# Altium project PCB_Project.PrjPcb
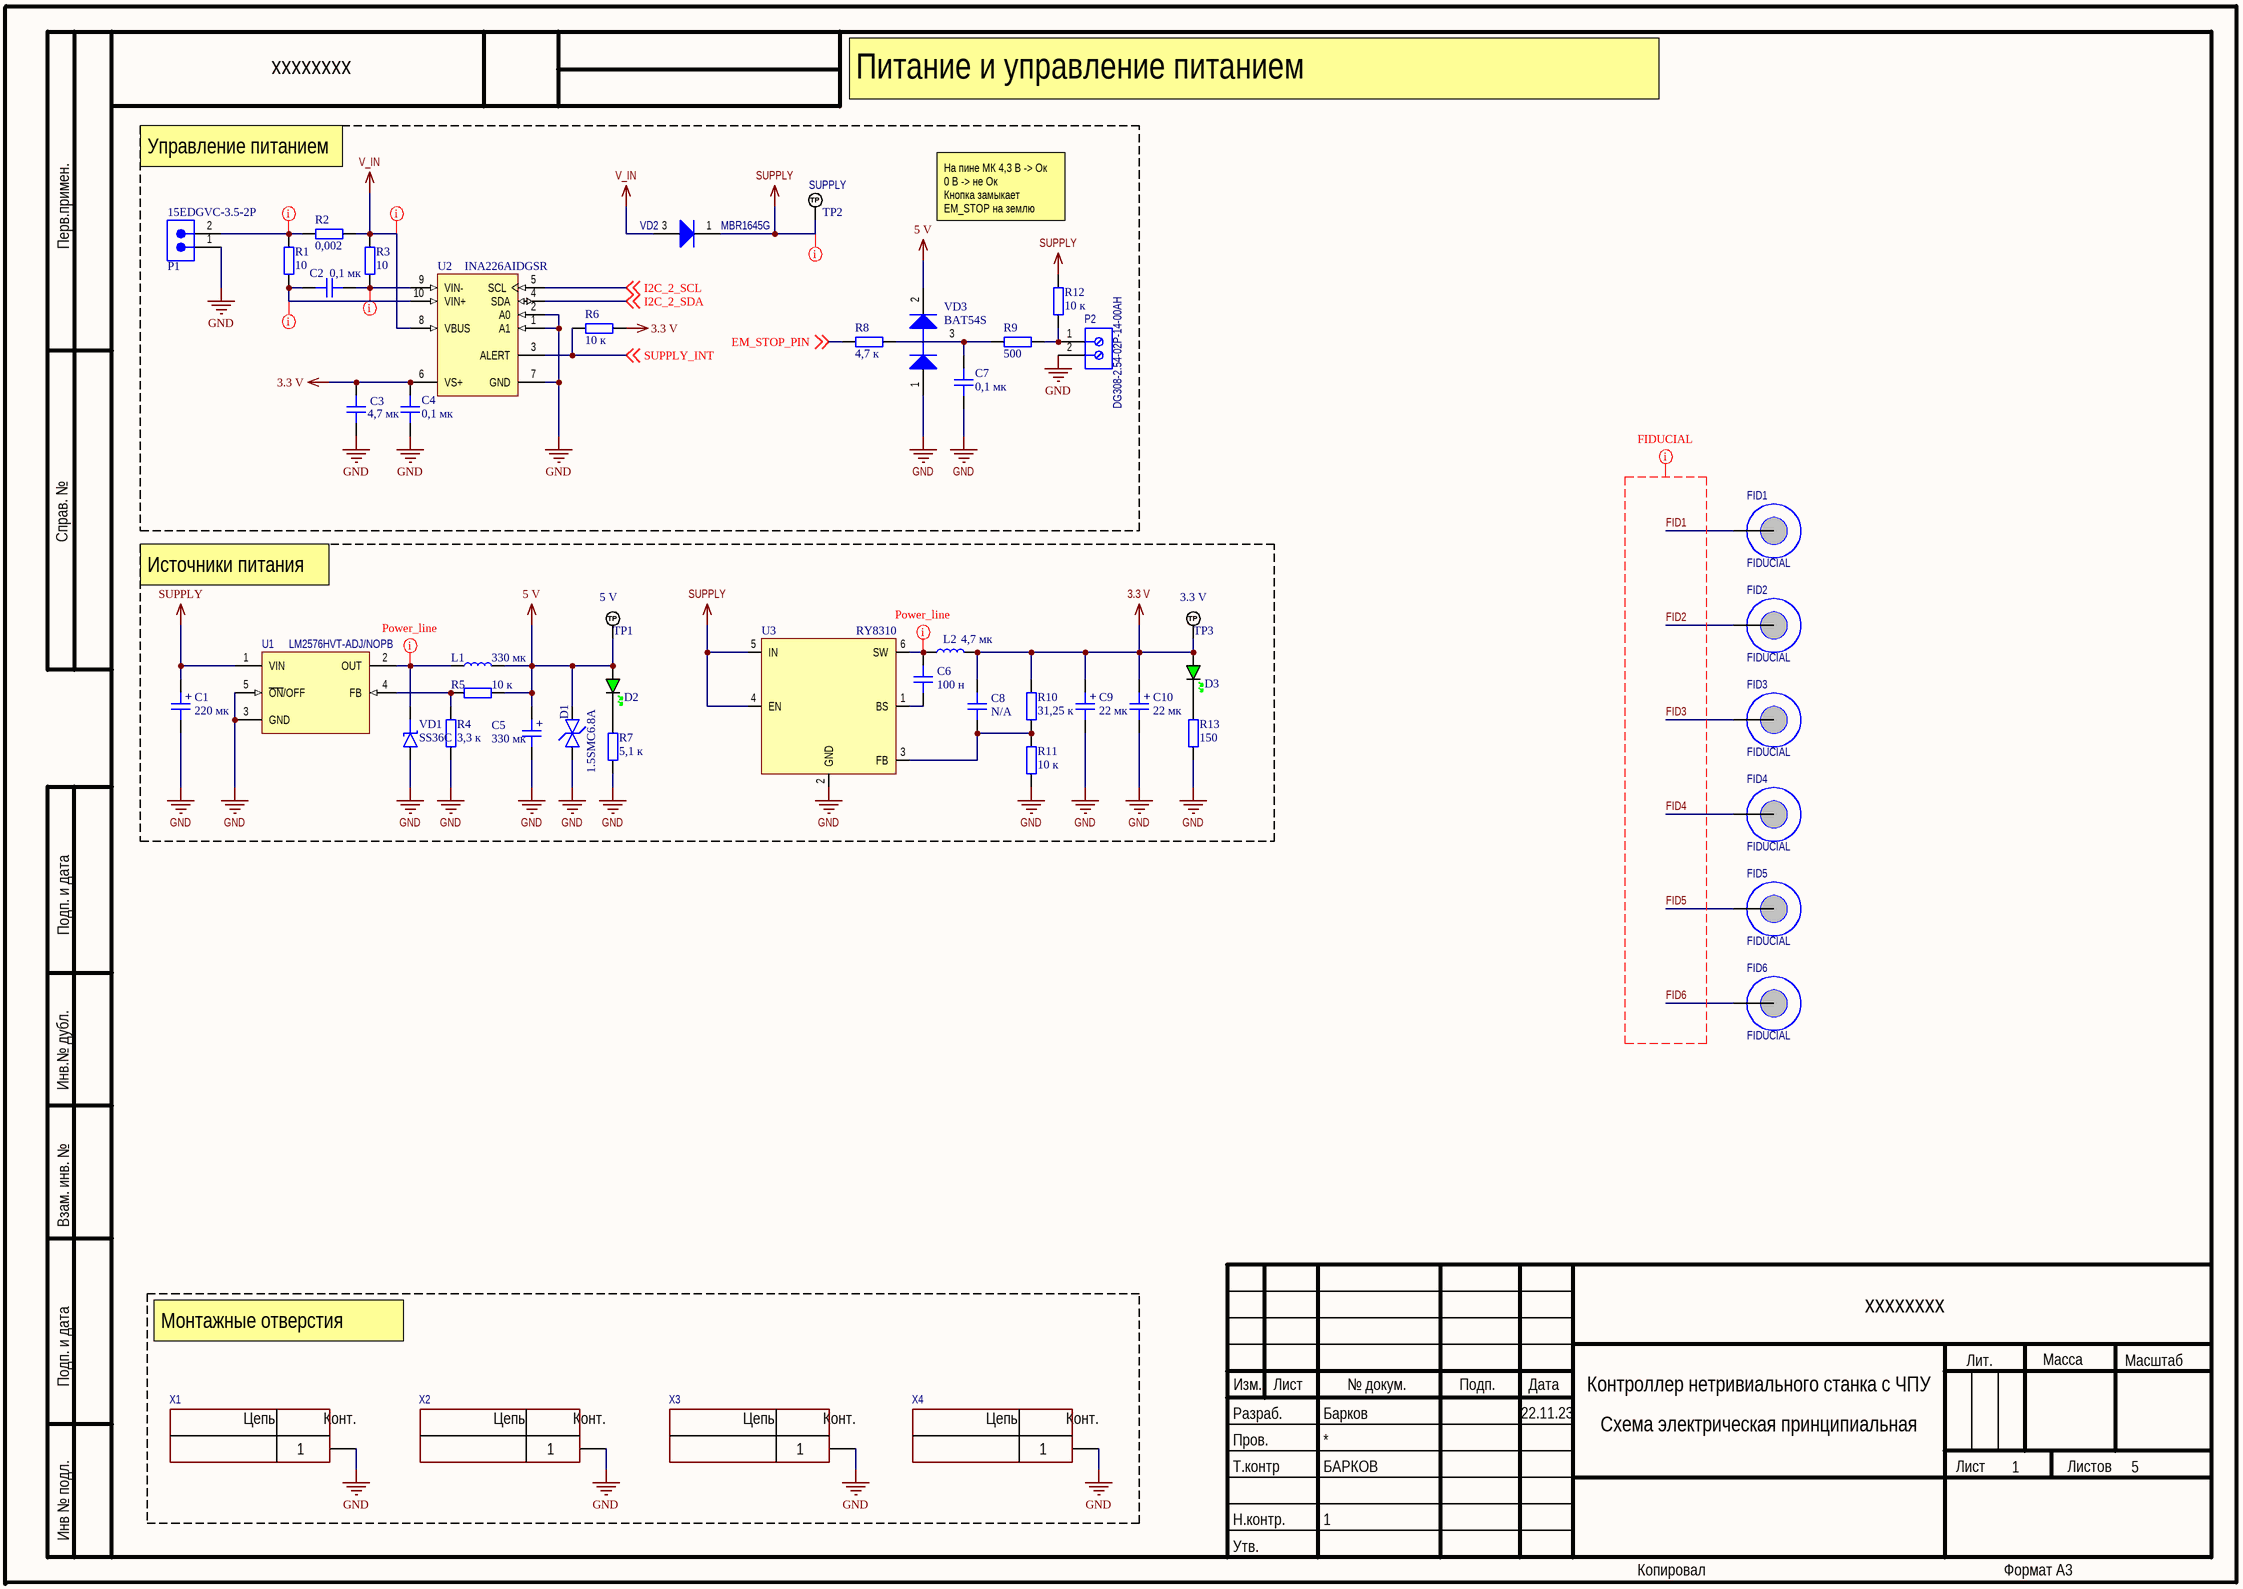
[diagram p0: Sheet1.SchDoc]
3 sheets, 190 parts. Net scope: global (net labels, ports and power ports of the same name join across sheets).
Board file: PCB1.PcbDoc
Sheets:
  Sheet1.SchDoc
  Sheet2.SchDoc
  Sheet4.SchDoc

## Sheet Sheet1.SchDoc: Контроллер нетривиального станка с ЧПУ
size 420 x 297 mm; Date: 22.11.23; Author: Барков; CompanyName: BarCockSemenConductor; DrawnBy: Барков; Engineer: БАРКОВ; Organization: BarCockSemenConductor; DocumentNumber: хххххххх; Revision: 1; SheetNumber: 1; SheetTotal: 5

### Parts
C1  220 мк  [D10C5H12.5]
C2  0,1 мк  [CAP_0603]
C3  4,7 мк  [CAP_0805]
C4  0,1 мк  [CAP_0603]
C5  330 мк  [D8C3.5H12]
C6  100 н  [CAP_0603]
C7  0,1 мк  [CAP_0603]
C8  N/A  [CAP_0603]
C9  22 мк  [TANTAL_B]
C10  22 мк  [TANTAL_B]
D1  1.5SMC6.8A  [SMC-DO-214AB]
D2  GREEN  [LED_0603_GREEN]  (value not drawn)
D3  GREEN  [LED_0603_GREEN]  (value not drawn)
FID1  FIDUCIAL  [FIDUCIAL]
FID2  FIDUCIAL  [FIDUCIAL]
FID3  FIDUCIAL  [FIDUCIAL]
FID4  FIDUCIAL  [FIDUCIAL]
FID5  FIDUCIAL  [FIDUCIAL]
FID6  FIDUCIAL  [FIDUCIAL]
L1  330 мк  [IND: B82477G4]
L2  4,7 мк  [NRS5020]
P1  15EDGVC-3.5-2P  [691321100002]
P2  DG308-2.54-02P-14-00AH  [PHOE-1725656-2]
R1  10  [RES_0603]
R2  0,002  [ch2512r]
R3  10  [RES_0603]
R4  3,3 к  [RES_0603]
R5  10 к  [RES_0603]
R6  10 к  [RES_0603]
R7  5,1 к  [RES_0603]
R8  4,7 к  [RES_0603]
R9  500  [RES_0603]
R10  31,25 к  [RES_0603]
R11  10 к  [RES_0603]
R12  10 к  [RES_0603]
R13  150  [RES_0603]
TP1  5 V  [PAD_RND_1MM]  (no BOM)
TP2  SUPPLY  [PAD_RND_1MM]  (no BOM)
TP3  3.3 V  [PAD_RND_1MM]  (no BOM)
U1  LM2576HVT-ADJ/NOPB  [KC0005A]
U2  INA226AIDGSR  [DGS0010A_L]
U3  RY8310  [SOT-23-6]
VD1  SS36C  [SMC-DO-214AB]
VD2  MBR1645G  [ONSC-TO-220-2-221B-04_E]
VD3  BAT54S  [ONSC-SOT-323-3-419-04_V]
X1  *  [CON: PADS 1x3mm]  (value not drawn)  (no BOM)
X2  *  [CON: PADS 1x3mm]  (value not drawn)  (no BOM)
X3  *  [CON: PADS 1x3mm]  (value not drawn)  (no BOM)
X4  *  [CON: PADS 1x3mm]  (value not drawn)  (no BOM)

### Nets
3.3 V: C3.2 C4.1 C8.2 C9.1 C10.1 D3.A L2.2 R6.2 R10.1 TP3.1(TP) U2.6(VS+)
5 V: C5.1 D1.K D2.A L1.2 R5.1 TP1.1(TP) VD3.2(K)
GND: C1.2 C3.1 C4.2 C5.2 C7.2 C9.2 C10.2 D1.A P1.1 P2.2 R4.1 R7.1 R11.2 R13.1 U1.3(GND) U1.5(~{ON}/OFF) U2.1(A1) U2.2(A0) U2.7(GND) U3.2(GND) VD1.A VD3.1(A) X1.1 X2.1 X3.1 X4.1
SUPPLY: C1.1 R12.2 TP2.1(TP) U1.1(VIN) U3.4(EN) U3.5(IN) VD2.1(K)
V_IN: R2.2 R3.1 U2.8(VBUS) VD2.3(A)
EM_STOP_PIN: R8.2 ; off-sheet EM_STOP_PIN
FID1: FID1.1
FID2: FID2.1
FID3: FID3.1
FID4: FID4.1
FID5: FID5.1
FID6: FID6.1
I2C_2_SCL: U2.5(SCL) ; off-sheet I2C_2_SCL
I2C_2_SDA: U2.4(SDA) ; off-sheet I2C_2_SDA
SUPPLY_INT: R6.1 U2.3(ALERT) ; off-sheet SUPPLY_INT
NetC2_1: C2.1 R3.2 U2.9(VIN-)
NetC2_2: C2.2 R1.2 U2.10(VIN+)
NetC6_1: C6.1 U3.1(BS)
NetC6_2: C6.2 L2.1 U3.6(SW)
NetC7_1: C7.1 R8.1 R9.2 VD3.3(K/A)
NetC8_1: C8.1 R10.2 R11.1 U3.3(FB)
NetD2_K: D2.K R7.2
NetD3_K: D3.K R13.2
NetL1_1: L1.1 U1.2(OUT) VD1.K
NetP1_2: P1.2 R1.1 R2.1
NetP2_1: P2.1 R9.1 R12.1
NetR4_2: R4.2 R5.2 U1.4(FB)

### Layout directives
net class Power_line: NetC6_2, NetL1_1
net class Low_Power_Line: NetC2_1, NetC2_2, NetP1_2, SUPPLY, V_IN
net class FIDUCIAL: FID1, FID2, FID3, FID4, FID5, FID6

### Notes on the sheet
- Питание и управление питанием
- Управление питанием
- На пине МК 4,3 В -> Ок
  0 В -> не Ок
  Кнопка замыкает EM_STOP на землю
- Источники питания
- Монтажные отверстия
- Перв.примен.
- Справ. №
- Подп. и дата
- Инв.№ дубл.
- Взам. инв. №
- Изм.
- Лист
- № докум.
- Подп.
- Дата
- Лит.
- Масса
- Масштаб
- Пров.
- Т.контр
- Разраб.
- Схема электрическая принципиальная
- 1
- Листов
- Инв № подл.
- Н.контр.
- Утв.
- Копировал
- Формат А3
- (in symbol 1-Connector) Цепь; Конт.
- (in symbol CAP_ALEL_16x16.5_25V) +

### Library data of the parts
C1 = CAP_ALEL_16x16.5_25V: Электролитический конденсатор; Voltage: 50; Type: CAP_ELECTROLYTIC; ChipDip: 9000565903; Model: JRB1H221M05001000120000B; Value: 220 мк; Mount: THT
C2 C4 C7 = CAP_0603: Керамический конденсатор; Type: CAP_CERAMIC; Value: 0,1 мк; ChipDip: *; Mount: SMD
C3 C6 C8 = CAP_0805: Керамический конденсатор; Type: CAP_CERAMIC; Mount: SMD
  C3: Value: 4,7 мк; ChipDip: *
  C6: Value: 100 н
  C8: Value: N/A
C5 = CAP_ALEL_16x16.5_25V: Электролитический конденсатор; Voltage: 16; Type: CAP_ELECTROLYTIC; ChipDip: 9000565907; Model: JRB1C331M03500800120000B; Value: 330 мк; Mount: THT
C9 C10 = CAP_ALEL_16x16.5_25V: Танталовый конденсатор; Voltage: 6,3; Type: CAP_TANTALUM; ChipDip: 9000629219; Value: 22 мк; Model: *; Mount: SMD
D1 = D_TVS_BI_SMC: Защитный диод; ChipDip: 9001169270; Value: 5 В; Type: DIODE; Model: 1.5SMC6.8A; Mount: SMD
D2 D3 = LED_0603_GREEN: Зелёный светодиод; Type: LED; Model: *; ChipDip: *; Value: GREEN; Mount: SMD
FID1-FID6 = FIDUCIAL: Реперная метка; Mount: SMD; Type: FIDUCIAL
L1 = NRS5020: Индуктор; ChipDip: 450851416; Type: INDUCTOR; Model: B82477G4334M; Value: 330 мк; Mount: SMD
L2 = NRS5020: Индуктор; ChipDip: 450851416; Type: INDUCTOR; Value: 4,7 мк; Mount: SMD
P1 = CMP-1502-01783-2: Раъёмный винтовой клеммник; ChipDip: 8025411938; Model: 15EDGVC-3.5-2P; Type: CONNETOR; Mount: THT
P2 = CMP-2000-05299-1: Винтовой клеммник; ChipDip: 63066; Model: DG308-2.54-02P-14-00AH; Type: CONNECTOR; Mount: THT
R1 R3-R9 R12 R13 = RES_0603: Резистор; Type: RESISTOR; ChipDip: *; Mount: SMD
  R1 R3: Value: 10
  R4: Value: 3,3 к
  R5 R6 R12: Value: 10 к
  R7: Value: 5,1 к
  R8: Value: 4,7 к
  R9: Value: 500
  R13: Value: 150
R2 = RES_0603: Резистор; ChipDip: 8001939518; Model: CRE2512-FZ-R002E-3; Value: 0,002; Type: RESISTOR; Mount: SMD
R10 R11 = RES_0805: Резистор; Type: RESISTOR; Mount: SMD
  R10: Value: 31,25 к
  R11: Value: 10 к
TP1-TP3 = TEST_POINT_RND_1MM: Type: *
  TP1: CustomTxt: 5 V
  TP2: CustomTxt: SUPPLY
  TP3: CustomTxt: 3.3 V
U1 = CMP-0069-01994-3: Понижающий DC-DC; ChipDip: 9000135775; ComponentLink1Description: Datasheet URL; ComponentLink1URL: http://www.ti.com/general/docs/lit/getliterature.tsp?genericPartNumber=LM2576HV&fileType=pdf; Type: IC; Model: LM2576HVT-ADJ/NOPB; Mount: THT
U2 = CMP-0704-00058-2: Измеритель мощности; ChipDip: 8026989887; ComponentLink2URL: http://www.ti.com/general/docs/lit/getliterature.tsp?genericPartNumber=INA226&fileType=pdf; ComponentLink1URL: http://www.ti.com/; ComponentLink3Description: Package Specification; ComponentLink2Description: Datasheet; ComponentLink3URL: http://www.ti.com/lit/ml/mpds035b/mpds035b.pdf; ComponentLink1Description: Manufacturer URL; Model: INA226AIDGSR; Type: IC; Mount: SMD
U3 = MT2492: Понижающий DC-DC; ChipDip: 8026700717; Model: RY8310; Type: IC; Mount: SMD
VD1 = D_SCHOTTKY_SMC: Диод; ChipDip: 9000982605; Type: DIODE; Value: SS36C; Mount: SMD
VD2 = CMP-1055-00599-1: Мощный диод; ChipDip: 9000520102; Type: DIODE; ComponentLink3URL: http://www.onsemi.com/pub_link/Collateral/BYW29-D.PDF; ComponentLink1URL: http://www.onsemi.com/; ComponentLink2URL: http://www.onsemi.cn/pub_link/Collateral/MBR1635-D.PDF; ComponentLink3Description: Package Specification; ComponentLink2Description: Datasheet; ComponentLink1Description: Manufacturer URL; Model: MBR1645G; Mount: THT
VD3 = CMP-1055-00559-1: Пара последовательных диодов; ChipDip: 9001106105; Type: DIODE; ComponentLink1URL: http://www.onsemi.com/; ComponentLink1Description: Manufacturer URL; ComponentLink3URL: http://www.onsemi.com/pub_link/Collateral/419-04.PDF; ComponentLink2URL: http://www.onsemi.cn/pub_link/Collateral/BAT54SWT1-D.PDF; ComponentLink3Description: Package Specification; ComponentLink2Description: Datasheet; Model: BAT54S; Mount: SMD
X1-X4 = 1-Connector

## Sheet Sheet2.SchDoc: Контроллер нетривиального станка с ЧПУ
size 420 x 297 mm; Author: Барков; CompanyName: BarCockSemenConductor; DrawnBy: Барков; Engineer: Барков; Organization: BarCockSemenConductor; DocumentNumber: хххххххх; Revision: 1; SheetNumber: 2; SheetTotal: 5
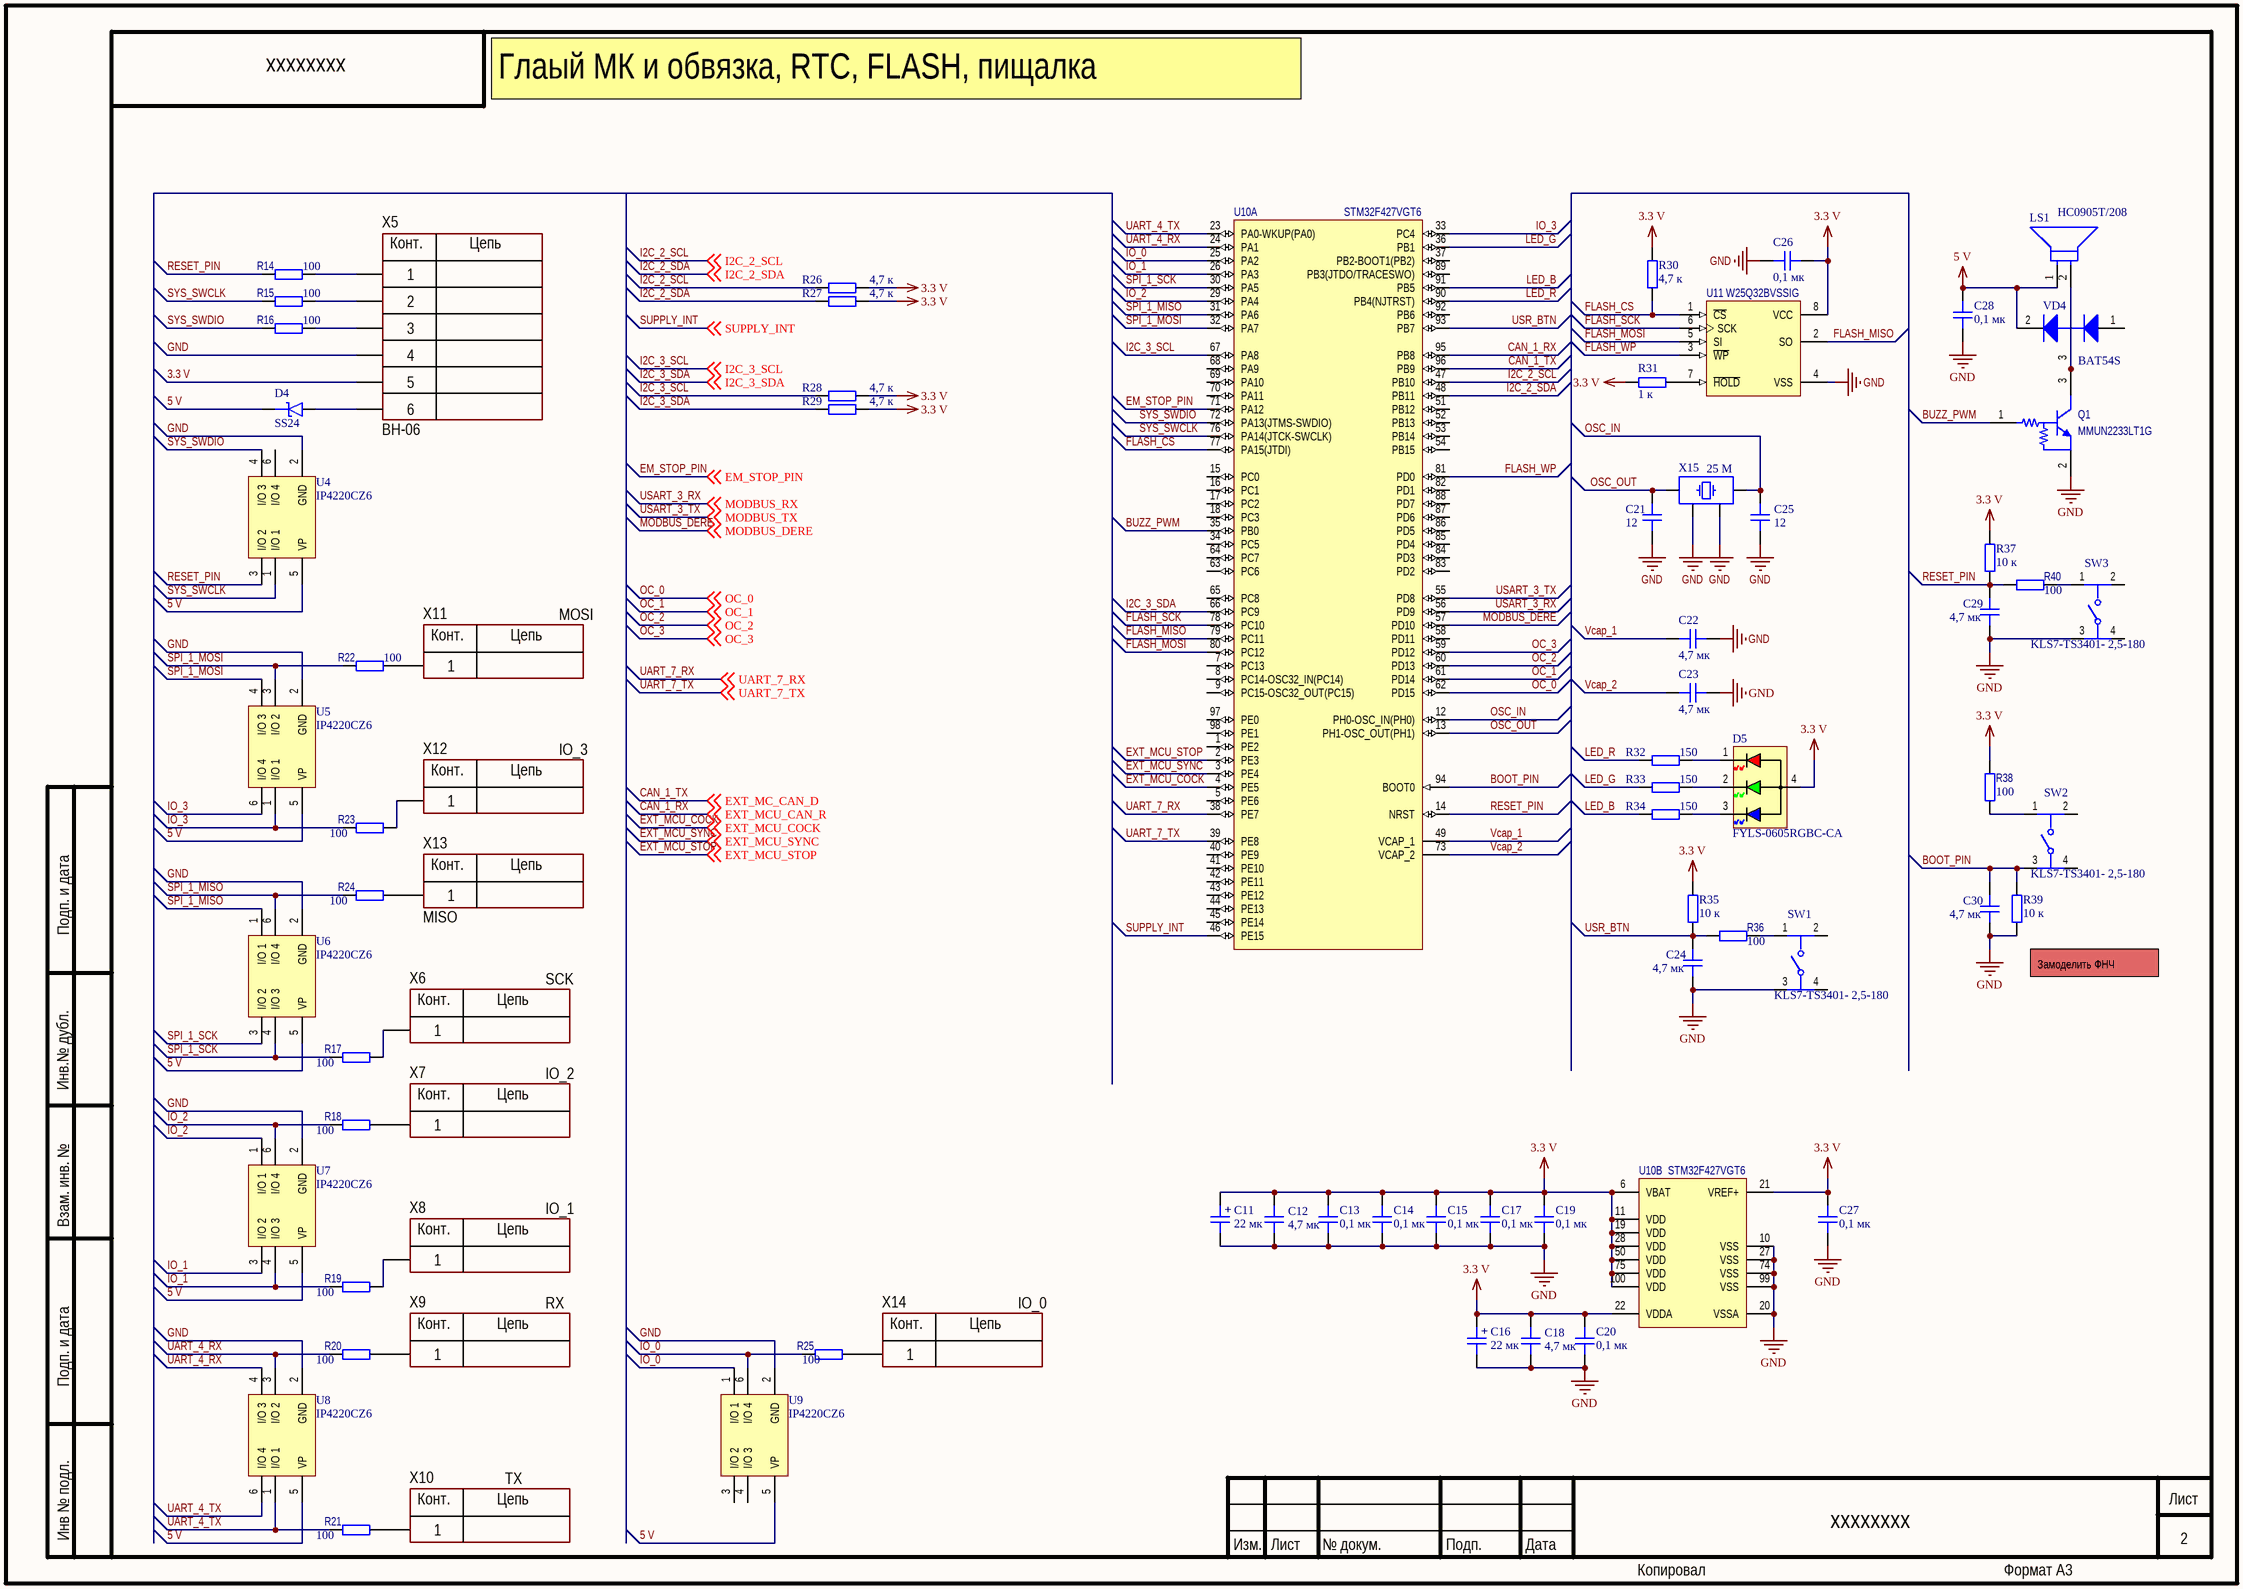
[diagram p1: Sheet2.SchDoc]

### Parts
C11  22 мк  [TANTAL_B]
C12  4,7 мк  [CAP_0805]
C13  0,1 мк  [CAP_0603]
C14  0,1 мк  [CAP_0603]
C15  0,1 мк  [CAP_0603]
C16  22 мк  [TANTAL_B]
C17  0,1 мк  [CAP_0603]
C18  4,7 мк  [CAP_0805]
C19  0,1 мк  [CAP_0603]
C20  0,1 мк  [CAP_0603]
C21  12  [CAP_0603]
C22  4,7 мк  [CAP_0805]
C23  4,7 мк  [CAP_0805]
C24  4,7 мк  [CAP_0805]
C25  12  [CAP_0603]
C26  0,1 мк  [CAP_0603]
C27  0,1 мк  [CAP_0603]
C28  0,1 мк  [CAP_0603]
C29  4,7 мк  [CAP_0805]
C30  4,7 мк  [CAP_0805]
D4  SS24  [DO-214AC-2 (SMA)]
D5  FYLS-0605RGBC-CA  [150080M153000]
LS1  HC0905T/208  [FP-SD1209-MFG]
Q1  MMUN2233LT1G  [ONSC-SOT-23-3-318-08_V]
R14  100  [RES_0603]
R15  100  [RES_0603]
R16  100  [RES_0603]
R17  100  [RES_0603]
R18  100  [RES_0603]
R19  100  [RES_0603]
R20  100  [RES_0603]
R21  100  [RES_0603]
R22  100  [RES_0603]
R23  100  [RES_0603]
R24  100  [RES_0603]
R25  100  [RES_0603]
R26  4,7 к  [RES_0603]
R27  4,7 к  [RES_0603]
R28  4,7 к  [RES_0603]
R29  4,7 к  [RES_0603]
R30  4,7 к  [RES_0603]
R31  1 к  [RES_0603]
R32  150  [RES_0603]
R33  150  [RES_0603]
R34  150  [RES_0603]
R35  10 к  [RES_0603]
R36  100  [RES_0603]
R37  10 к  [RES_0603]
R38  100  [RES_0603]
R39  10 к  [RES_0603]
R40  100  [RES_0603]
SW1  KLS7-TS3401- 2,5-180  [FP-PTS810_SJG_250_SMTR_LF-MFG]
SW2  KLS7-TS3401- 2,5-180  [FP-PTS810_SJG_250_SMTR_LF-MFG]
SW3  KLS7-TS3401- 2,5-180  [FP-PTS810_SJG_250_SMTR_LF-MFG]
U4  IP4220CZ6  [NXP-SOT457_L]
U5  IP4220CZ6  [NXP-SOT457_L]
U6  IP4220CZ6  [NXP-SOT457_L]
U7  IP4220CZ6  [NXP-SOT457_L]
U8  IP4220CZ6  [NXP-SOT457_L]
U9  IP4220CZ6  [NXP-SOT457_L]
U10  STM32F427VGT6  [STM-LQFP100_M]  (parts A,B of 2)
U11  W25Q32BVSSIG  [SOIJ-SM8_L]
VD4  BAT54S  [ONSC-SOT-323-3-419-04_V]
X5  BH-06  [CON: IDC-6MS]
X6  SCK  [CON: PADS 1x1mm]  (no BOM)
X7  IO_2  [CON: PADS 1x1mm]  (no BOM)
X8  IO_1  [CON: PADS 1x1mm]  (no BOM)
X9  RX  [CON: PADS 1x1mm]  (no BOM)
X10  TX  [CON: PADS 1x1mm]  (no BOM)
X11  MOSI  [CON: PADS 1x1mm]  (no BOM)
X12  IO_3  [CON: PADS 1x1mm]  (no BOM)
X13  MISO  [CON: PADS 1x1mm]  (no BOM)
X14  IO_0  [CON: PADS 1x1mm]  (no BOM)
X15  25 M  [XTAL_3225]

### Nets
3.3 V: C11.1 C12.1 C13.1 C14.1 C15.1 C16.1 C17.1 C18.1 C19.1 C20.1 C26.2 C27.1 D5.4(AC) R26.2 R27.2 R28.2 R29.2 R30.2 R31.1 R35.1 R37.1 R38.2 U10.6(VBAT) U10.11(VDD) U10.19(VDD) U10.21(VREF+) U10.22(VDDA) U10.28(VDD) U10.50(VDD) U10.75(VDD) U10.100(VDD) U11.8(VCC) X5.5
5 V: C28.1 D4.K LS1.1(C) U4.5(VP) U5.5(VP) U6.5(VP) U7.5(VP) U8.5(VP) U9.5(VP) VD4.2(K)
GND: C11.2 C12.2 C13.2 C14.2 C15.2 C16.2 C17.2 C18.2 C19.2 C20.2 C21.2 C22.1 C23.1 C24.2 C25.2 C26.1 C27.2 C28.2 C29.2 C30.2 Q1.2(E) R39.2 SW1.3 SW3.3 U4.2(GND) U5.2(GND) U6.2(GND) U7.2(GND) U8.2(GND) U9.2(GND) U10.10(VSS) U10.20(VSSA) U10.27(VSS) U10.74(VSS) U10.99(VSS) U11.4(VSS) X5.4 X15.2 X15.4
BOOT_PIN: C30.1 R39.1 SW2.3 U10.94(BOOT0)
BUZZ_PWM: Q1.1(B) U10.35(PB0)
CAN_1_RX: U10.95(PB8) ; off-sheet EXT_MCU_CAN_R  [also labelled EXT_MCU_CAN_R]
CAN_1_TX: U10.96(PB9) ; off-sheet EXT_MC_CAN_D  [also labelled EXT_MC_CAN_D]
EM_STOP_PIN: U10.71(PA12) ; off-sheet EM_STOP_PIN
EXT_MCU_COCK: U10.4(PE5) ; off-sheet EXT_MCU_COCK
EXT_MCU_STOP: U10.2(PE3) ; off-sheet EXT_MCU_STOP
EXT_MCU_SYNC: U10.3(PE4) ; off-sheet EXT_MCU_SYNC
FLASH_CS: R30.1 U10.77(PA15(JTDI)) U11.1(~{CS})
FLASH_MISO: U10.79(PC11) U11.2(SO)
FLASH_MOSI: U10.80(PC12) U11.5(SI)
FLASH_SCK: U10.78(PC10) U11.6(SCK)
FLASH_WP: U10.81(PD0) U11.3(~{WP})
I2C_2_SCL: R26.1 U10.47(PB10) ; off-sheet I2C_2_SCL
I2C_2_SDA: R27.1 U10.48(PB11) ; off-sheet I2C_2_SDA
I2C_3_SCL: R28.1 U10.67(PA8) ; off-sheet I2C_3_SCL
I2C_3_SDA: R29.1 U10.66(PC9) ; off-sheet I2C_3_SDA
IO_0: R25.1 U9.1(I/O_1) U9.6(I/O_4) U10.25(PA2)
IO_1: R19.1 U7.3(I/O_2) U7.4(I/O_3) U10.26(PA3)
IO_2: R18.1 U7.1(I/O_1) U7.6(I/O_4) U10.29(PA4)
IO_3: R23.1 U5.1(I/O_1) U5.6(I/O_4) U10.33(PC4)
LED_B: R34.1 U10.91(PB5)
LED_G: R33.1 U10.36(PB1)
LED_R: R32.1 U10.90(PB4(NJTRST))
MODBUS_DERE: U10.57(PD10) ; off-sheet MODBUS_DERE
OC_0: U10.62(PD15) ; off-sheet OС_0  [also labelled OС_0]
OC_1: U10.61(PD14) ; off-sheet OС_1  [also labelled OС_1]
OC_2: U10.60(PD13) ; off-sheet OС_2  [also labelled OС_2]
OC_3: U10.59(PD12) ; off-sheet OС_3  [also labelled OС_3]
OSC_IN: C25.1 U10.12(PH0-OSC_IN(PH0)) X15.3
OSC_OUT: C21.1 U10.13(PH1-OSC_OUT(PH1)) X15.1
RESET_PIN: C29.1 R14.1 R37.2 R40.2 U4.3(I/O_2) U10.14(NRST)
SPI_1_MISO: R24.1 U6.1(I/O_1) U6.6(I/O_4) U10.31(PA6)
SPI_1_MOSI: R22.1 U5.3(I/O_2) U5.4(I/O_3) U10.32(PA7)
SPI_1_SCK: R17.1 U6.3(I/O_2) U6.4(I/O_3) U10.30(PA5)
SUPPLY_INT: U10.46(PE15) ; off-sheet SUPPLY_INT
SYS_SWCLK: R15.1 U4.1(I/O_1) U10.76(PA14(JTCK-SWCLK))
SYS_SWDIO: R16.1 U4.4(I/O_3) U10.72(PA13(JTMS-SWDIO))
UART_4_RX: R20.1 U8.3(I/O_2) U8.4(I/O_3) U10.24(PA1)
UART_4_TX: R21.1 U8.1(I/O_1) U8.6(I/O_4) U10.23(PA0-WKUP(PA0))
UART_7_RX: U10.38(PE7) ; off-sheet UART_7_RX
UART_7_TX: U10.39(PE8) ; off-sheet UART_7_TX
USART_3_RX: U10.56(PD9) ; off-sheet MODBUS_RX  [also labelled MODBUS_RX]
USART_3_TX: U10.55(PD8) ; off-sheet MODBUS_TX  [also labelled MODBUS_TX]
USR_BTN: C24.1 R35.2 R36.2 U10.93(PB7)
Vcap_1: C22.2 U10.49(VCAP_1)
Vcap_2: C23.2 U10.73(VCAP_2)
NetD4_A: D4.A X5.6
NetD5_1: D5.1(CR) R32.2
NetD5_2: D5.2(CG) R33.2
NetD5_3: D5.3(CB) R34.2
NetLS1_2: LS1.2(A) Q1.3(C) VD4.3(K/A)
NetR14_2: R14.2 X5.1
NetR15_2: R15.2 X5.2
NetR16_2: R16.2 X5.3
NetR17_2: R17.2 X6.1
NetR18_2: R18.2 X7.1
NetR19_2: R19.2 X8.1
NetR20_2: R20.2 X9.1
NetR21_2: R21.2 X10.1
NetR22_2: R22.2 X11.1
NetR23_2: R23.2 X12.1
NetR24_2: R24.2 X13.1
NetR25_2: R25.2 X14.1
NetR31_2: R31.2 U11.7(~{HOLD})
NetR36_1: R36.1 SW1.1
NetR38_1: R38.1 SW2.1
NetR40_1: R40.1 SW3.1

Not connected (* = marked no-connect by the designer): SW1 2 4; SW2 2 4; SW3 2 4; U4 6(I/O_4); U9 3(I/O_2) 4(I/O_3); U10 1(PE2) 5(PE6) 7(PC13) 8(PC14-OSC32_IN(PC14)) 9(PC15-OSC32_OUT(PC15)) 15(PC0) 16(PC1) 17(PC2) 18(PC3) 34(PC5) 37(PB2-BOOT1(PB2)) 40(PE9) 41(PE10) 42(PE11) 43(PE12) 44(PE13) 45(PE14) 51(PB12) 52(PB13) 53(PB14) 54(PB15) 58(PD11) 63(PC6) 64(PC7) 65(PC8) 68(PA9) 69(PA10) 70(PA11) 82(PD1) 83(PD2) 84(PD3) 85(PD4) 86(PD5) 87(PD6) 88(PD7) 89(PB3(JTDO/TRACESWO)) 92(PB6) 97(PE0) 98(PE1); VD4 1(A)

### Notes on the sheet
- Глаый МК и обвязка, RTC, FLASH, пищалка
- Замоделить ФНЧ
- Подп. и дата
- Инв.№ дубл.
- Взам. инв. №
- Инв № подл.
- Изм.
- Лист
- № докум.
- Подп.
- Дата
- Копировал
- Формат А3
- (in symbol 1-Connector) Конт.; Цепь
- (in symbol 6-Connector) Конт.; Цепь
- (in symbol CAP_ALEL_16x16.5_25V) +

### Library data of the parts
C11 C16 = CAP_ALEL_16x16.5_25V: Capacitor SMD Aluminium Electrolytic 16x16.5mm 25V; Voltage: 6,3; Type: CAP_TANTALUM; ChipDip: 9000629219; Value: 22 мк; Model: *
C12 C18 C22-C24 C29 C30 = CAP_0805: Capacitor SMD 0805; Type: CAP_CERAMIC; Value: 4,7 мк; ChipDip: *
C13-C15 C17 C19-C21 C25-C28 = CAP_0603: Capacitor SMD 0603; Type: CAP_CERAMIC; ChipDip: *
  C13-C15 C17 C19 C20 C26-C28: Value: 0,1 мк
  C21 C25: Value: 12
D4 = D_SCHOTTKY_SMA: Diode Schottky SMD SMA (DO-214AA); ChipDip: 9001106111; Model: SS24; Type: DIODE
D5 = 150080M153000: RGB LED Common Anode SMD Diffused 0805 Top View; ChipDip: 9001271035; Model: FYLS-0605RGBC-CA; Type: LED
LS1 = CMP-08413-000009-1: AUDIO MAGNETIC XDCR 3-6V TH; ChipDip: 9000783782; Model: HC0905T/208; Type: SOUND
Q1 = CMP-0630-00251-1: Digital Transistor (BRT), R1=4.7 kOhm, R2=47 kOhm, NPN Transistor, 3-Pin SOT-23, Pb-Free, Tape and Reel; ChipDip: 8021345115; Type: MOSFET; ComponentLink3URL: http://www.onsemi.cn/pub_link/Collateral/318-08.PDF; ComponentLink1URL: http://www.onsemi.com/; ComponentLink3Description: Package Specification; ComponentLink2URL: http://www.onsemi.cn/pub_link/Collateral/DTC143Z-D.PDF; ComponentLink1Description: Manufacturer URL; ComponentLink2Description: Datasheet; Model: MMUN2233LT1G
R14-R40 = RES_0603: Resistor SMD 0603; Type: RESISTOR; ChipDip: *
  R14-R25 R36 R38 R40: Value: 100
  R26-R30: Value: 4,7 к
  R31: Value: 1 к
  R32-R34: Value: 150
  R35 R37 R39: Value: 10 к
SW1-SW3 = CMP-10040-000011-1: SWITCH TACTILE SPST-NO 0.05A 16V; ChipDip: 9000372886; ComponentLink2URL: https://www.ckswitches.com/media/1476/pts810.pdf; ComponentLink2Description: Datasheet; Model: KLS7-TS3401- 2,5-180; Type: SWITCH
U4-U9 = CMP-2000-06457-1: ChipDip: 9001067611; Model: IP4220CZ6; Type: IC
U10 = CMP-0243-00028-2: ARM Cortex-M4 32-bit MCU+FPU, 210 DMIPS, 1024 kB Flash, 256 kB Internal RAM, 82 I/Os, 100-pin LQFP, -40 to 85 degC, Tray; ChipDip: 9001570276; ComponentLink1Description: Manufacturer URL; ComponentLink2URL: http://www.st.com/st-web-ui/static/active/en/resource/technical/document/datasheet/DM00071990.pdf; ComponentLink1URL: http://www.st.com/web/en/home.html; ComponentLink2Description: Datasheet; ComponentLink3Description: Package Specification; ComponentLink3URL: http://www.st.com/st-web-ui/static/active/en/resource/technical/document/data_brief/DM00071938.pdf; Type: IC; Model: STM32F427VGT6
U11 = CMP-0165-00255-1: 1 Mbit SPI Bus Serial EEPROM, 8-Pin SOIC, Industrial Temperature, Tape and Reel; Model: W25Q32BVSSIG; Type: IC; ChipDip: *
VD4 = CMP-1055-00559-1: ChipDip: 9001106105; Type: DIODE; ComponentLink1URL: http://www.onsemi.com/; ComponentLink1Description: Manufacturer URL; ComponentLink3URL: http://www.onsemi.com/pub_link/Collateral/419-04.PDF; ComponentLink2URL: http://www.onsemi.cn/pub_link/Collateral/BAT54SWT1-D.PDF; ComponentLink3Description: Package Specification; ComponentLink2Description: Datasheet; Model: BAT54S
X5 = 6-Connector: ChipDip: 9000058155; Model: BH-06; Type: CONNECTOR
X6-X14 = 1-Connector
  X6: SIGNAL: SCK
  X7: SIGNAL: IO_2
  X8: SIGNAL: IO_1
  X9: SIGNAL: RX
  X10: SIGNAL: TX
  X11: SIGNAL: MOSI
  X12: SIGNAL: IO_3
  X13: SIGNAL: MISO
  X14: SIGNAL: IO_0
X15 = TSX-3225_24.0000MF15X-AC: Crystal SMD 24MHz 10PPM 7pF 3225; ChipDip: 8026581531; Model: X322525MOB4SI; Value: 25 M; Type: CRYSTAL

## Sheet Sheet4.SchDoc: Контроллер нетривиального станка с ЧПУ
size 420 x 297 mm; Author: Барков; CompanyName: BarCockSemenConductor; DrawnBy: Барков; Engineer: Барков; Organization: BarCockSemenConductor; DocumentNumber: хххххххх; SheetNumber: 4; SheetTotal: 5; DocumentName: Sheet1.SCHDOC
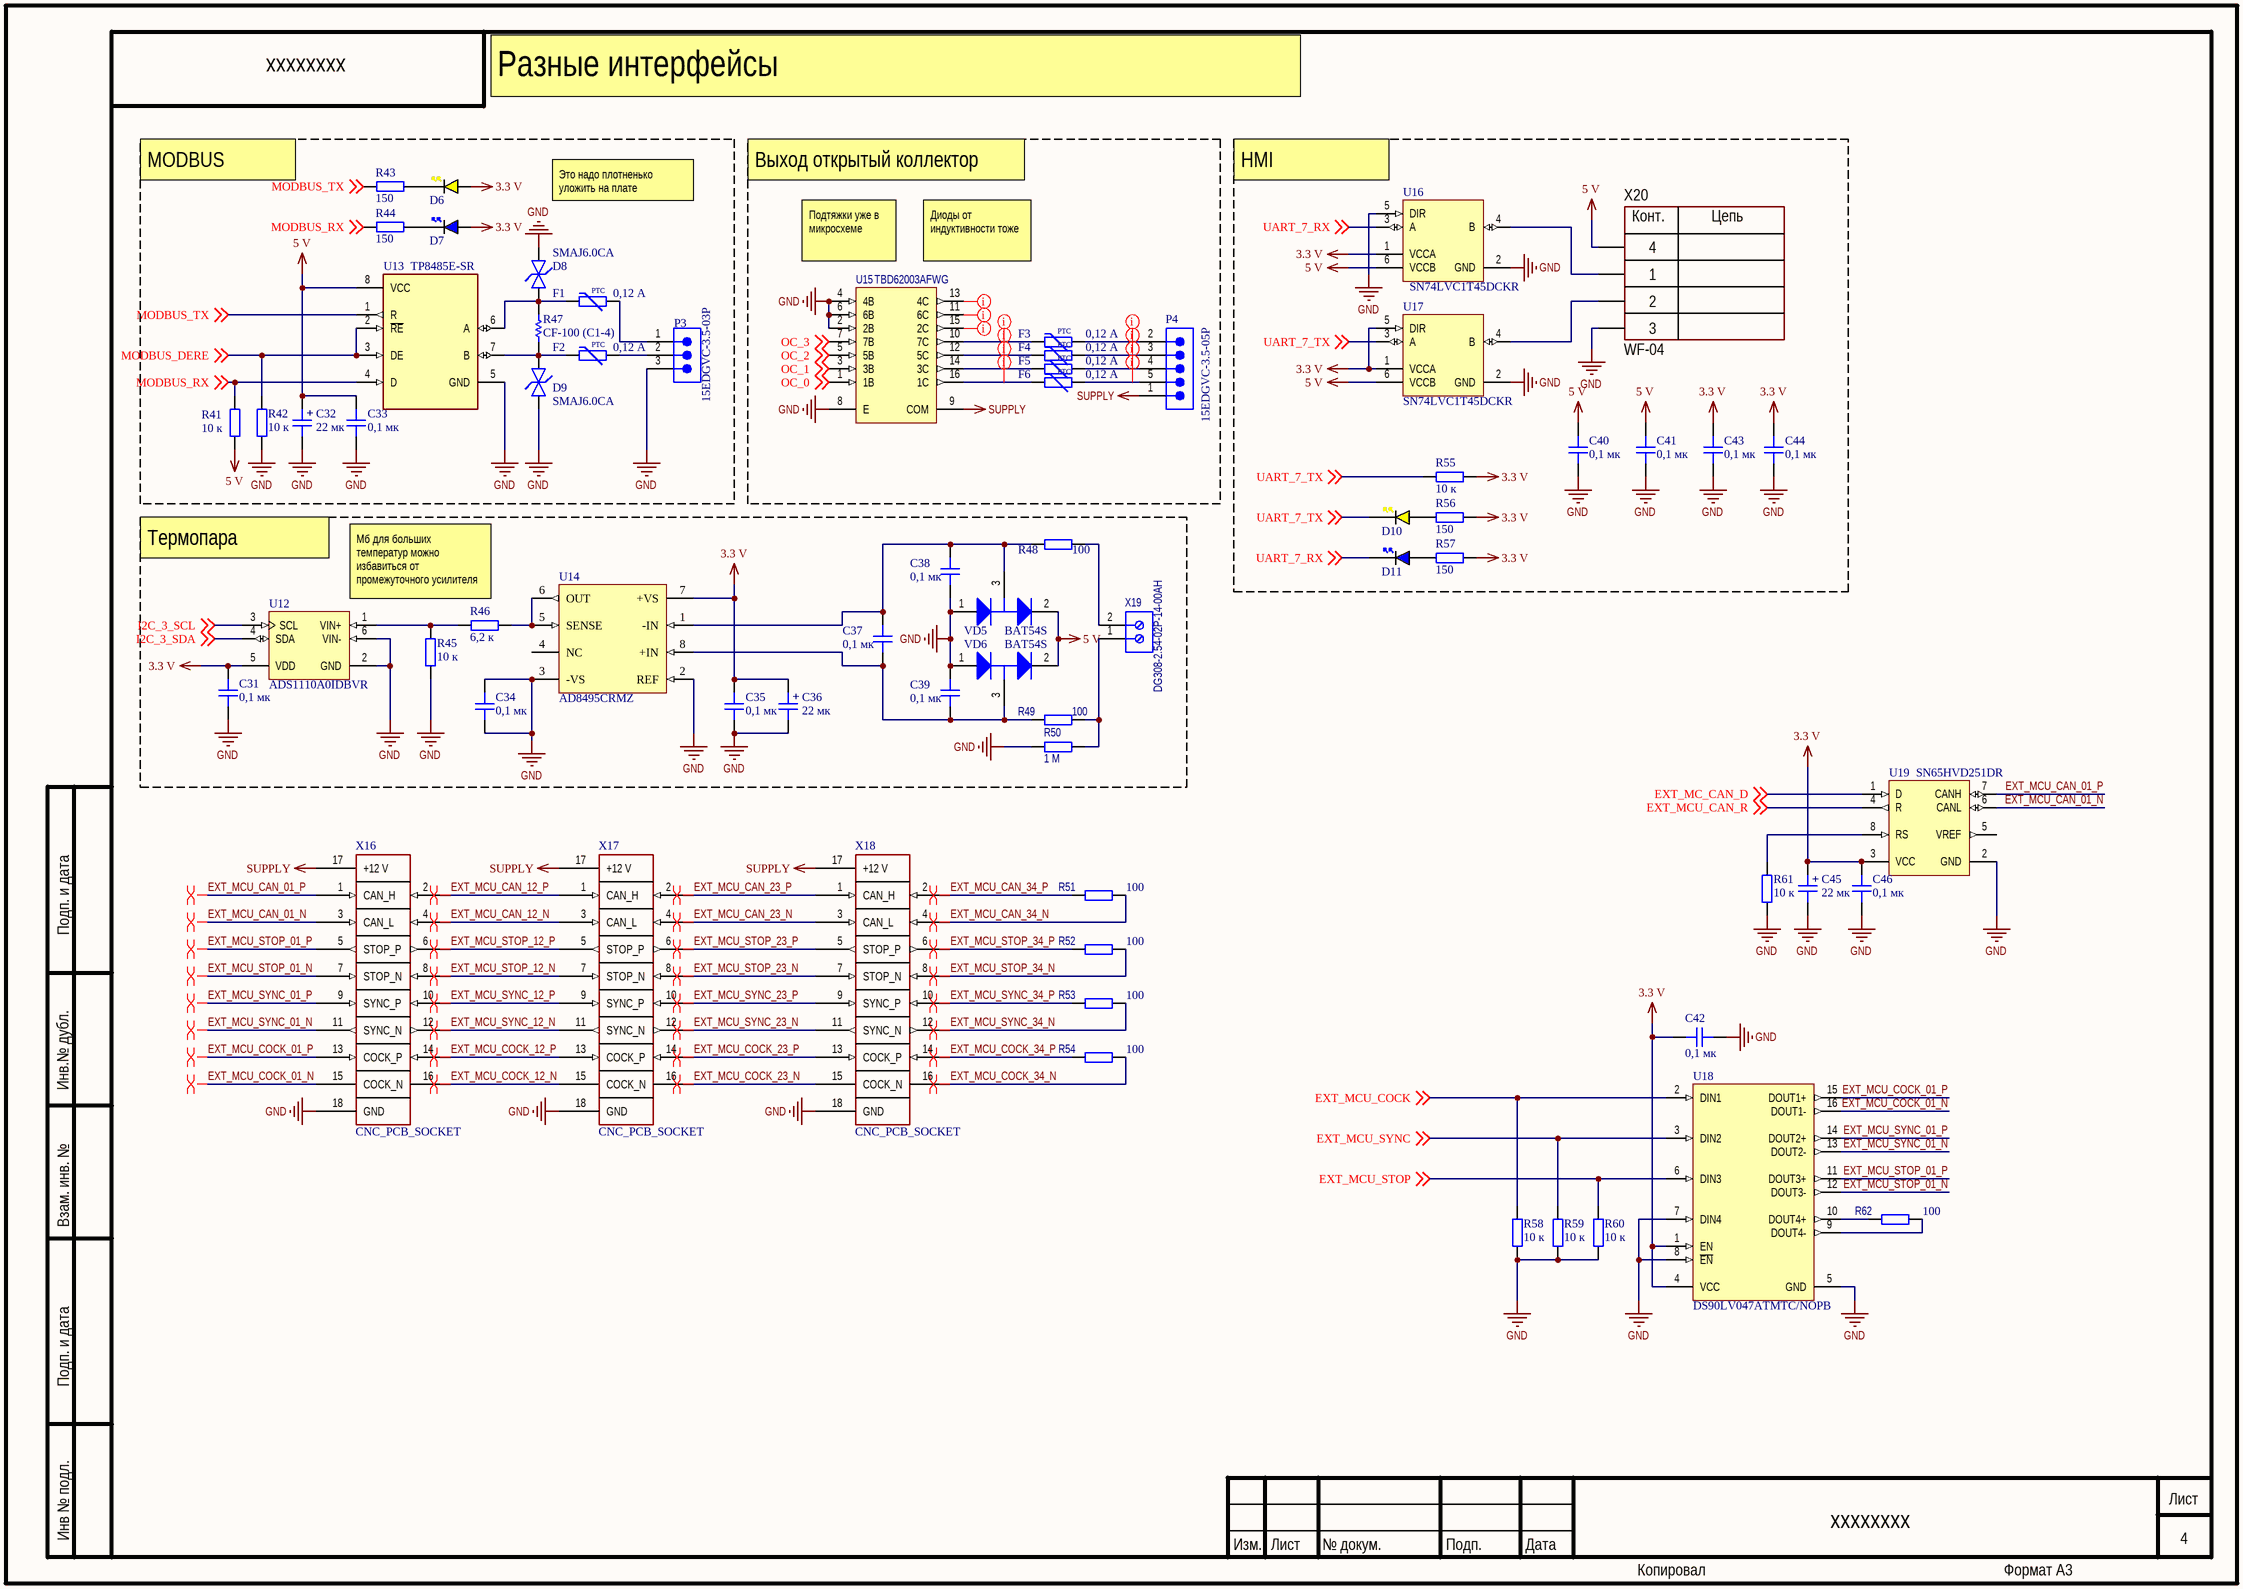
[diagram p2: Sheet4.SchDoc]

### Parts
C31  0,1 мк  [CAP_0603]
C32  22 мк  [TANTAL_B]
C33  0,1 мк  [CAP_0603]
C34  0,1 мк  [CAP_0603]
C35  0,1 мк  [CAP_0603]
C36  22 мк  [TANTAL_B]
C37  0,1 мк  [CAP_0603]
C38  0,1 мк  [CAP_0603]
C39  0,1 мк  [CAP_0603]
C40  0,1 мк  [CAP_0603]
C41  0,1 мк  [CAP_0603]
C42  0,1 мк  [CAP_0603]
C43  0,1 мк  [CAP_0603]
C44  0,1 мк  [CAP_0603]
C45  22 мк  [TANTAL_B]
C46  0,1 мк  [CAP_0603]
D6  YELLOW  [LED_0603_YELLOW]  (value not drawn)
D7  BLUE  [LED_0603_BLUE]  (value not drawn)
D8  SMAJ6.0CA  [SMA]
D9  SMAJ6.0CA  [SMA]
D10  YELLOW  [LED_0603_YELLOW]  (value not drawn)
D11  BLUE  [LED_0603_BLUE]  (value not drawn)
F1  0,12 А  [FUSE_1206]
F2  0,12 А  [FUSE_1206]
F3  0,12 А  [FUSE_1206]
F4  0,12 А  [FUSE_1206]
F5  0,12 А  [FUSE_1206]
F6  0,12 А  [FUSE_1206]
P3  15EDGVC-3.5-03P  [691321100003]
P4  15EDGVC-3.5-05P  [691321100005]
R41  10 к  [RES_0603]
R42  10 к  [RES_0603]
R43  150  [RES_0603]
R44  150  [RES_0603]
R45  10 к  [RES_0603]
R46  6,2 к  [RES_0603]
R47  CF-100 (С1-4)  [OMTE-RES7X2.5-2]
R48  100  [RES_0603]
R49  100  [RES_0603]
R50  1 М  [RES_0603]
R51  100  [RES_0603]
R52  100  [RES_0603]
R53  100  [RES_0603]
R54  100  [RES_0603]
R55  10 к  [RES_0603]
R56  150  [RES_0603]
R57  150  [RES_0603]
R58  10 к  [RES_0603]
R59  10 к  [RES_0603]
R60  10 к  [RES_0603]
R61  10 к  [RES_0603]
R62  100  [RES_0603]
U12  ADS1110A0IDBVR  [TI-DBV6_M]
U13  TP8485E-SR  [FP-D0008A-MFG]
U14  AD8495CRMZ  [FP-RM-8-IPC_A]
U15  TBD62003AFWG  [D0016A_M]
U16  SN74LVC1T45DCKR  [DCK0006A_L]
U17  SN74LVC1T45DCKR  [DCK0006A_L]
U18  DS90LV047ATMTC/NOPB  [MTC16_M]
U19  SN65HVD251DR  [D0008A_N]
VD5  BAT54S  [ONSC-SOT-323-3-419-04_V]
VD6  BAT54S  [ONSC-SOT-323-3-419-04_V]
X16  CNC_PCB_SOCKET  [CNC_PCB_SOCKET]  (no BOM)
X17  CNC_PCB_SOCKET  [CNC_PCB_SOCKET]  (no BOM)
X18  CNC_PCB_SOCKET  [CNC_PCB_SOCKET]  (no BOM)
X19  DG308-2.54-02P-14-00AH  [PHOE-1725656-2]
X20  WF-04  [CON: WF-04]

### Nets
3.3 V: C31.1 C35.1 C36.1 C42.1 C43.1 C44.1 C45.1 C46.1 D6.A D7.A R55.1 R56.2 R57.2 U12.5(VDD) U14.7(+VS) U16.1(VCCA) U17.1(VCCA) U17.5(DIR) U18.1(EN) U18.4(VCC) U19.3(VCC)
5 V: C32.1 C33.1 C40.1 C41.1 R41.2 U13.8(VCC) U16.6(VCCB) U17.6(VCCB) VD5.2(K) VD6.2(K) X20.4
GND: C31.2 C32.2 C33.2 C34.1 C34.2 C35.2 C36.2 C38.2 C39.1 C40.2 C41.2 C42.2 C43.2 C44.2 C45.2 C46.2 D8.K D9.A P3.3 R42.1 R45.1 R50.2 R58.2 R59.2 R60.1 R61.1 U12.2(GND) U12.6(VIN-) U13.5(GND) U14.2(REF) U14.3(-VS) U15.2(2B) U15.4(4B) U15.6(6B) U15.8(E) U16.2(GND) U16.5(DIR) U17.2(GND) U18.5(GND) U18.7(DIN4) U18.8(~{EN}) U19.2(GND) VD5.1(A) VD6.1(A) X16.18(GND) X17.18(GND) X18.18(GND) X20.3
SUPPLY: P4.1 U15.9(COM) X16.17(+12_V) X17.17(+12_V) X18.17(+12_V)
EXT_MC_CAN_D: U19.1(D) ; off-sheet EXT_MC_CAN_D  [project net CAN_1_TX]
EXT_MCU_CAN_01_N: U19.6(CANL) X16.3(CAN_L)
EXT_MCU_CAN_01_P: U19.7(CANH) X16.1(CAN_H)
EXT_MCU_CAN_12_N: X16.4(CAN_L) X17.3(CAN_L)
EXT_MCU_CAN_12_P: X16.2(CAN_H) X17.1(CAN_H)
EXT_MCU_CAN_23_N: X17.4(CAN_L) X18.3(CAN_L)
EXT_MCU_CAN_23_P: X17.2(CAN_H) X18.1(CAN_H)
EXT_MCU_CAN_34_N: R51.1 X18.4(CAN_L)
EXT_MCU_CAN_34_P: R51.2 X18.2(CAN_H)
EXT_MCU_CAN_R: U19.4(R) ; off-sheet EXT_MCU_CAN_R  [project net CAN_1_RX]
EXT_MCU_COCK: R58.1 U18.2(DIN1) ; off-sheet EXT_MCU_COCK
EXT_MCU_COCK_01_N: U18.16(DOUT1-) X16.15(COCK_N)
EXT_MCU_COCK_01_P: U18.15(DOUT1+) X16.13(COCK_P)
EXT_MCU_COCK_12_N: X16.16(COCK_N) X17.15(COCK_N)
EXT_MCU_COCK_12_P: X16.14(COCK_P) X17.13(COCK_P)
EXT_MCU_COCK_23_N: X17.16(COCK_N) X18.15(COCK_N)
EXT_MCU_COCK_23_P: X17.14(COCK_P) X18.13(COCK_P)
EXT_MCU_COCK_34_N: R54.1 X18.16(COCK_N)
EXT_MCU_COCK_34_P: R54.2 X18.14(COCK_P)
EXT_MCU_STOP: R60.2 U18.6(DIN3) ; off-sheet EXT_MCU_STOP
EXT_MCU_STOP_01_N: U18.12(DOUT3-) X16.7(STOP_N)
EXT_MCU_STOP_01_P: U18.11(DOUT3+) X16.5(STOP_P)
EXT_MCU_STOP_12_N: X16.8(STOP_N) X17.7(STOP_N)
EXT_MCU_STOP_12_P: X16.6(STOP_P) X17.5(STOP_P)
EXT_MCU_STOP_23_N: X17.8(STOP_N) X18.7(STOP_N)
EXT_MCU_STOP_23_P: X17.6(STOP_P) X18.5(STOP_P)
EXT_MCU_STOP_34_N: R52.1 X18.8(STOP_N)
EXT_MCU_STOP_34_P: R52.2 X18.6(STOP_P)
EXT_MCU_SYNC: R59.1 U18.3(DIN2) ; off-sheet EXT_MCU_SYNC
EXT_MCU_SYNC_01_N: U18.13(DOUT2-) X16.11(SYNC_N)
EXT_MCU_SYNC_01_P: U18.14(DOUT2+) X16.9(SYNC_P)
EXT_MCU_SYNC_12_N: X16.12(SYNC_N) X17.11(SYNC_N)
EXT_MCU_SYNC_12_P: X16.10(SYNC_P) X17.9(SYNC_P)
EXT_MCU_SYNC_23_N: X17.12(SYNC_N) X18.11(SYNC_N)
EXT_MCU_SYNC_23_P: X17.10(SYNC_P) X18.9(SYNC_P)
EXT_MCU_SYNC_34_N: R53.1 X18.12(SYNC_N)
EXT_MCU_SYNC_34_P: R53.2 X18.10(SYNC_P)
I2C_3_SCL: U12.3(SCL) ; off-sheet I2C_3_SCL
I2C_3_SDA: U12.4(SDA) ; off-sheet I2C_3_SDA
MODBUS_DERE: R42.2 U13.2(~{RE}) U13.3(DE) ; off-sheet MODBUS_DERE
MODBUS_RX: R41.1 R44.1 U13.4(D) ; off-sheet MODBUS_RX  [project net USART_3_RX]
MODBUS_TX: R43.1 U13.1(R) ; off-sheet MODBUS_TX  [project net USART_3_TX]
OС_0: U15.1(1B) ; off-sheet OС_0  [project net OC_0]
OС_1: U15.3(3B) ; off-sheet OС_1  [project net OC_1]
OС_2: U15.5(5B) ; off-sheet OС_2  [project net OC_2]
OС_3: U15.7(7B) ; off-sheet OС_3  [project net OC_3]
UART_7_RX: D11.K U16.3(A) ; off-sheet UART_7_RX
UART_7_TX: D10.K R55.2 U17.3(A) ; off-sheet UART_7_TX
NetC37_1: C37.1 C38.1 R48.1 U14.1(-IN) VD5.3(K/A)
NetC37_2: C37.2 C39.2 R49.1 U14.8(+IN) VD6.3(K/A)
NetD6_K: D6.K R43.2
NetD7_K: D7.K R44.2
NetD8_A: D8.A F1.2 R47.1 U13.6(A)
NetD9_K: D9.K F2.2 R47.2 U13.7(B)
NetD10_A: D10.A R56.1
NetD11_A: D11.A R57.1
NetF1_1: F1.1 P3.1
NetF2_1: F2.1 P3.2
NetF3_1: F3.1 P4.2
NetF3_2: F3.2 U15.10(7C)
NetF4_1: F4.1 P4.3
NetF4_2: F4.2 U15.12(5C)
NetF5_1: F5.1 P4.4
NetF5_2: F5.2 U15.14(3C)
NetF6_1: F6.1 P4.5
NetF6_2: F6.2 U15.16(1C)
NetR45_2: R45.2 R46.2 U12.1(VIN+)
NetR46_1: R46.1 U14.5(SENSE) U14.6(OUT)
NetR48_2: R48.2 X19.2
NetR49_2: R49.2 R50.1 X19.1
NetR61_2: R61.2 U19.8(RS)
NetR62_1: R62.1 U18.9(DOUT4-)
NetR62_2: R62.2 U18.10(DOUT4+)
NetU16_4: U16.4(B) X20.1
NetU17_4: U17.4(B) X20.2

Not connected (* = marked no-connect by the designer): U14 4(NC); U15 11(6C) 13(4C) 15(2C); U19 5(VREF)

### Layout directives
differential pair: EXT_MCU_CAN_01_N, EXT_MCU_CAN_01_P, EXT_MCU_CAN_12_N, EXT_MCU_CAN_12_P, EXT_MCU_CAN_23_N, EXT_MCU_CAN_23_P, EXT_MCU_CAN_34_N, EXT_MCU_CAN_34_P, EXT_MCU_COCK_01_N, EXT_MCU_COCK_01_P, EXT_MCU_COCK_12_N, EXT_MCU_COCK_12_P, EXT_MCU_COCK_23_N, EXT_MCU_COCK_23_P, EXT_MCU_COCK_34_N, EXT_MCU_COCK_34_P, EXT_MCU_STOP_01_N, EXT_MCU_STOP_01_P, EXT_MCU_STOP_12_N, EXT_MCU_STOP_12_P, EXT_MCU_STOP_23_N, EXT_MCU_STOP_23_P, EXT_MCU_STOP_34_N, EXT_MCU_STOP_34_P, EXT_MCU_SYNC_01_N, EXT_MCU_SYNC_01_P, EXT_MCU_SYNC_12_N, EXT_MCU_SYNC_12_P, EXT_MCU_SYNC_23_N, EXT_MCU_SYNC_23_P, EXT_MCU_SYNC_34_N, EXT_MCU_SYNC_34_P
net class Low_Power_Line: NetF3_1, NetF3_2, NetF4_1, NetF4_2, NetF5_1, NetF5_2, NetF6_1, NetF6_2, NetU15_11, NetU15_13, NetU15_15

### Notes on the sheet
- Разные интерфейсы
- MODBUS
- Выход открытый коллектор
- (near U16) HMI
- Это надо плотненько уложить на плате
- (near U15) Подтяжки уже в микросхеме
- (near U15) Диоды от индуктивности тоже
- Термопара
- Мб для больших температур можно избавиться от промежуточного усилителя
- Подп. и дата
- Инв.№ дубл.
- Взам. инв. №
- Инв № подл.
- Изм.
- Лист
- № докум.
- Подп.
- Дата
- Копировал
- Формат А3
- (in symbol 4-Connector) Конт.; Цепь
- (in symbol CAP_ALEL_16x16.5_25V) +
- (in symbol FUSE_PPTC_1206) PTC

### Library data of the parts
C31 C33-C35 C37-C44 C46 = CAP_0603: as C2 on sheet Sheet1; Value: 0,1 мк; ChipDip: *; Mount: SMD
C32 C36 C45 = CAP_ALEL_16x16.5_25V: as C9 on sheet Sheet1; Value: 22 мк; Model: *; Mount: SMD
D6 D10 = LED_0603_YELLOW: Жёлтый светодиод; Type: LED; ChipDip: *; Value: YELLOW; Model: *; Mount: SMD
D7 D11 = LED_0805_BLUE: Синий светодиод; Type: LED; ChipDip: *; Value: BLUE; Model: *; Mount: SMD
D8 D9 = D_TVS_BI_SMC: Защитный диод; pin to pad: A>1 K>2; Type: DIODE; Value: 9001169246; Model: SMAJ6.0CA; ChipDip: *; Mount: SMD
F1-F6 = FUSE_PPTC_1206: Самовосстанавливающийся предохранитель; Model: MF-NSMF012-2; ChipDip: 9000072610; Type: FUSE; Value: 0,12 А; Mount: SMD
P3 = CMP-1502-01784-2: Винтовой клеммник; ChipDip: 9000592977; Type: CONNECTOR; Model: 15EDGVC-3.5-03P; Mount: THT
P4 = CMP-1502-01786-2: Винтовой клеммник; ChipDip: 8754518577; Model: 15EDGVC-3.5-05P; Type: CONNECTOR; Mount: THT
R41-R45 R48-R62 = RES_0603: Резистор; Type: RESISTOR; ChipDip: *; Mount: SMD
  R41 R42 R45 R55 R58-R61: Value: 10 к
  R43 R44 R56 R57: Value: 150
  R48 R49 R51-R54 R62: Value: 100
  R50: Value: 1 М
R46 = RES_0603: Резистор; ChipDip: 9000079731; Value: 6,2 к; Type: RESISTOR; Mount: SMD
R47 = CMP-2000-06865-1: Резистор; ChipDip: 1471; Value: 120; Model: CF-100 (С1-4); Type: RESISTOR; Mount: THT
U12 = CMP-0003-00257-2: АЦП с I2C; ChipDip: 2502826194; ComponentLink3URL: http://www.ti.com/litv/pdf/mpds026h; ComponentLink1Description: Manufacturer URL; ComponentLink1URL: http://www.ti.com/; ComponentLink2URL: http://www.ti.com/general/docs/lit/getliterature.tsp?genericPartNumber=ADS1110&fileType=pdf; ComponentLink2Description: Datasheet; ComponentLink3Description: Package Specification; Model: ADS1110A0IDBVR; Type: IC; Mount: SMD
U13 = CMP-04875-000009-1: Конвертер UART <-> RS485; ChipDip: 9001699468; ComponentLink2URL: http://www.ti.com/lit/ds/symlink/sn65hvd11.pdf; ComponentLink2Description: Datasheet; Model: TP8485E-SR; Type: IC; Mount: SMD
U14 = CMP-0887-00061-2: Усилитель термопары; ChipDip: 9000996824; Type: IC; Model: AD8495CRMZ; Mount: SMD
U15 = CMP-2000-04953-1: Сборка транзисторов Дарлингтона; ChipDip: 9000629083; Model: TBD62003AFWG; Type: IC; Mount: SMD
U16 U17 = CMP-0859-00452-3: Конвертер уровней; ChipDip: 9000140400; Type: IC; Model: SN74LVC1T45DCKR; Mount: SMD
U18 = CMP-0058-01148-2: Драйвер LVDS; ChipDip: 9000448213; ComponentLink1Description: DS90LV047A Datasheet; ComponentLink1URL: http://www.national.com/ds/DS/DS90LV047A.pdf; ComponentLink2Description: DS90LV047A Web Page; ComponentLink2URL: http://www.national.com/pf/DS/DS90LV047A.html; ComponentLink3Description: MTC16 Package Page; ComponentLink3URL: http://www.national.com/packaging/folders/mtc16.html; Model: DS90LV047ATMTC/NOPB; Type: IC; Mount: SMD
U19 = CMP-0315-00074-2: Драйвер CAN; ChipDip: 9000342409; ComponentLink1Description: Datasheet; ComponentLink1URL: http://www.ti.com/general/docs/lit/getliterature.tsp?genericPartNumber=SN65HVD251&fileType=pdf; Type: IC; Model: SN65HVD251DR; Mount: SMD
VD5 VD6 = CMP-1055-00559-1: as VD3 on sheet Sheet1; ComponentLink1URL: http://www.onsemi.com/; ComponentLink1Description: Manufacturer URL; ComponentLink3URL: http://www.onsemi.com/pub_link/Collateral/419-04.PDF; ComponentLink2URL: http://www.onsemi.cn/pub_link/Collateral/BAT54SWT1-D.PDF; ComponentLink3Description: Package Specification; ComponentLink2Description: Datasheet; Model: BAT54S; Mount: SMD
X19 = CMP-2000-05299-1: Рахъёмный винтовой клеммник; ChipDip: 63066; Model: DG308-2.54-02P-14-00AH; Type: CONNECTOR; Mount: THT
X20 = 4-Connector: Штыревой разъём; ChipDip: 8007166683; Model: WF-04; Type: CONNECTOR; Mount: THT

## Nets that join several sheets
3.3 V: Sheet1 (11 pins), Sheet2 (33 pins), Sheet4 (21 pins)
5 V: Sheet1 (7 pins), Sheet2 (10 pins), Sheet4 (11 pins)
GND: Sheet1 (26 pins), Sheet2 (39 pins), Sheet4 (48 pins)
SUPPLY: Sheet1 (7 pins), Sheet4 (5 pins)
CAN_1_RX: Sheet2 (U10.95), Sheet4 (U19.4)
CAN_1_TX: Sheet2 (U10.96), Sheet4 (U19.1)
EM_STOP_PIN: Sheet1 (R8.2), Sheet2 (U10.71)
EXT_MCU_COCK: Sheet2 (U10.4), Sheet4 (R58.1 U18.2)
EXT_MCU_STOP: Sheet2 (U10.2), Sheet4 (R60.2 U18.6)
EXT_MCU_SYNC: Sheet2 (U10.3), Sheet4 (R59.1 U18.3)
I2C_2_SCL: Sheet1 (U2.5), Sheet2 (R26.1 U10.47)
I2C_2_SDA: Sheet1 (U2.4), Sheet2 (R27.1 U10.48)
I2C_3_SCL: Sheet2 (R28.1 U10.67), Sheet4 (U12.3)
I2C_3_SDA: Sheet2 (R29.1 U10.66), Sheet4 (U12.4)
MODBUS_DERE: Sheet2 (U10.57), Sheet4 (R42.2 U13.2 U13.3)
OC_0: Sheet2 (U10.62), Sheet4 (U15.1)
OC_1: Sheet2 (U10.61), Sheet4 (U15.3)
OC_2: Sheet2 (U10.60), Sheet4 (U15.5)
OC_3: Sheet2 (U10.59), Sheet4 (U15.7)
SUPPLY_INT: Sheet1 (R6.1 U2.3), Sheet2 (U10.46)
UART_7_RX: Sheet2 (U10.38), Sheet4 (D11.K U16.3)
UART_7_TX: Sheet2 (U10.39), Sheet4 (D10.K R55.2 U17.3)
USART_3_RX: Sheet2 (U10.56), Sheet4 (R41.1 R44.1 U13.4)
USART_3_TX: Sheet2 (U10.55), Sheet4 (R43.1 U13.1)